# EAGLE schematic ps2 (EAGLE 9.6.1)
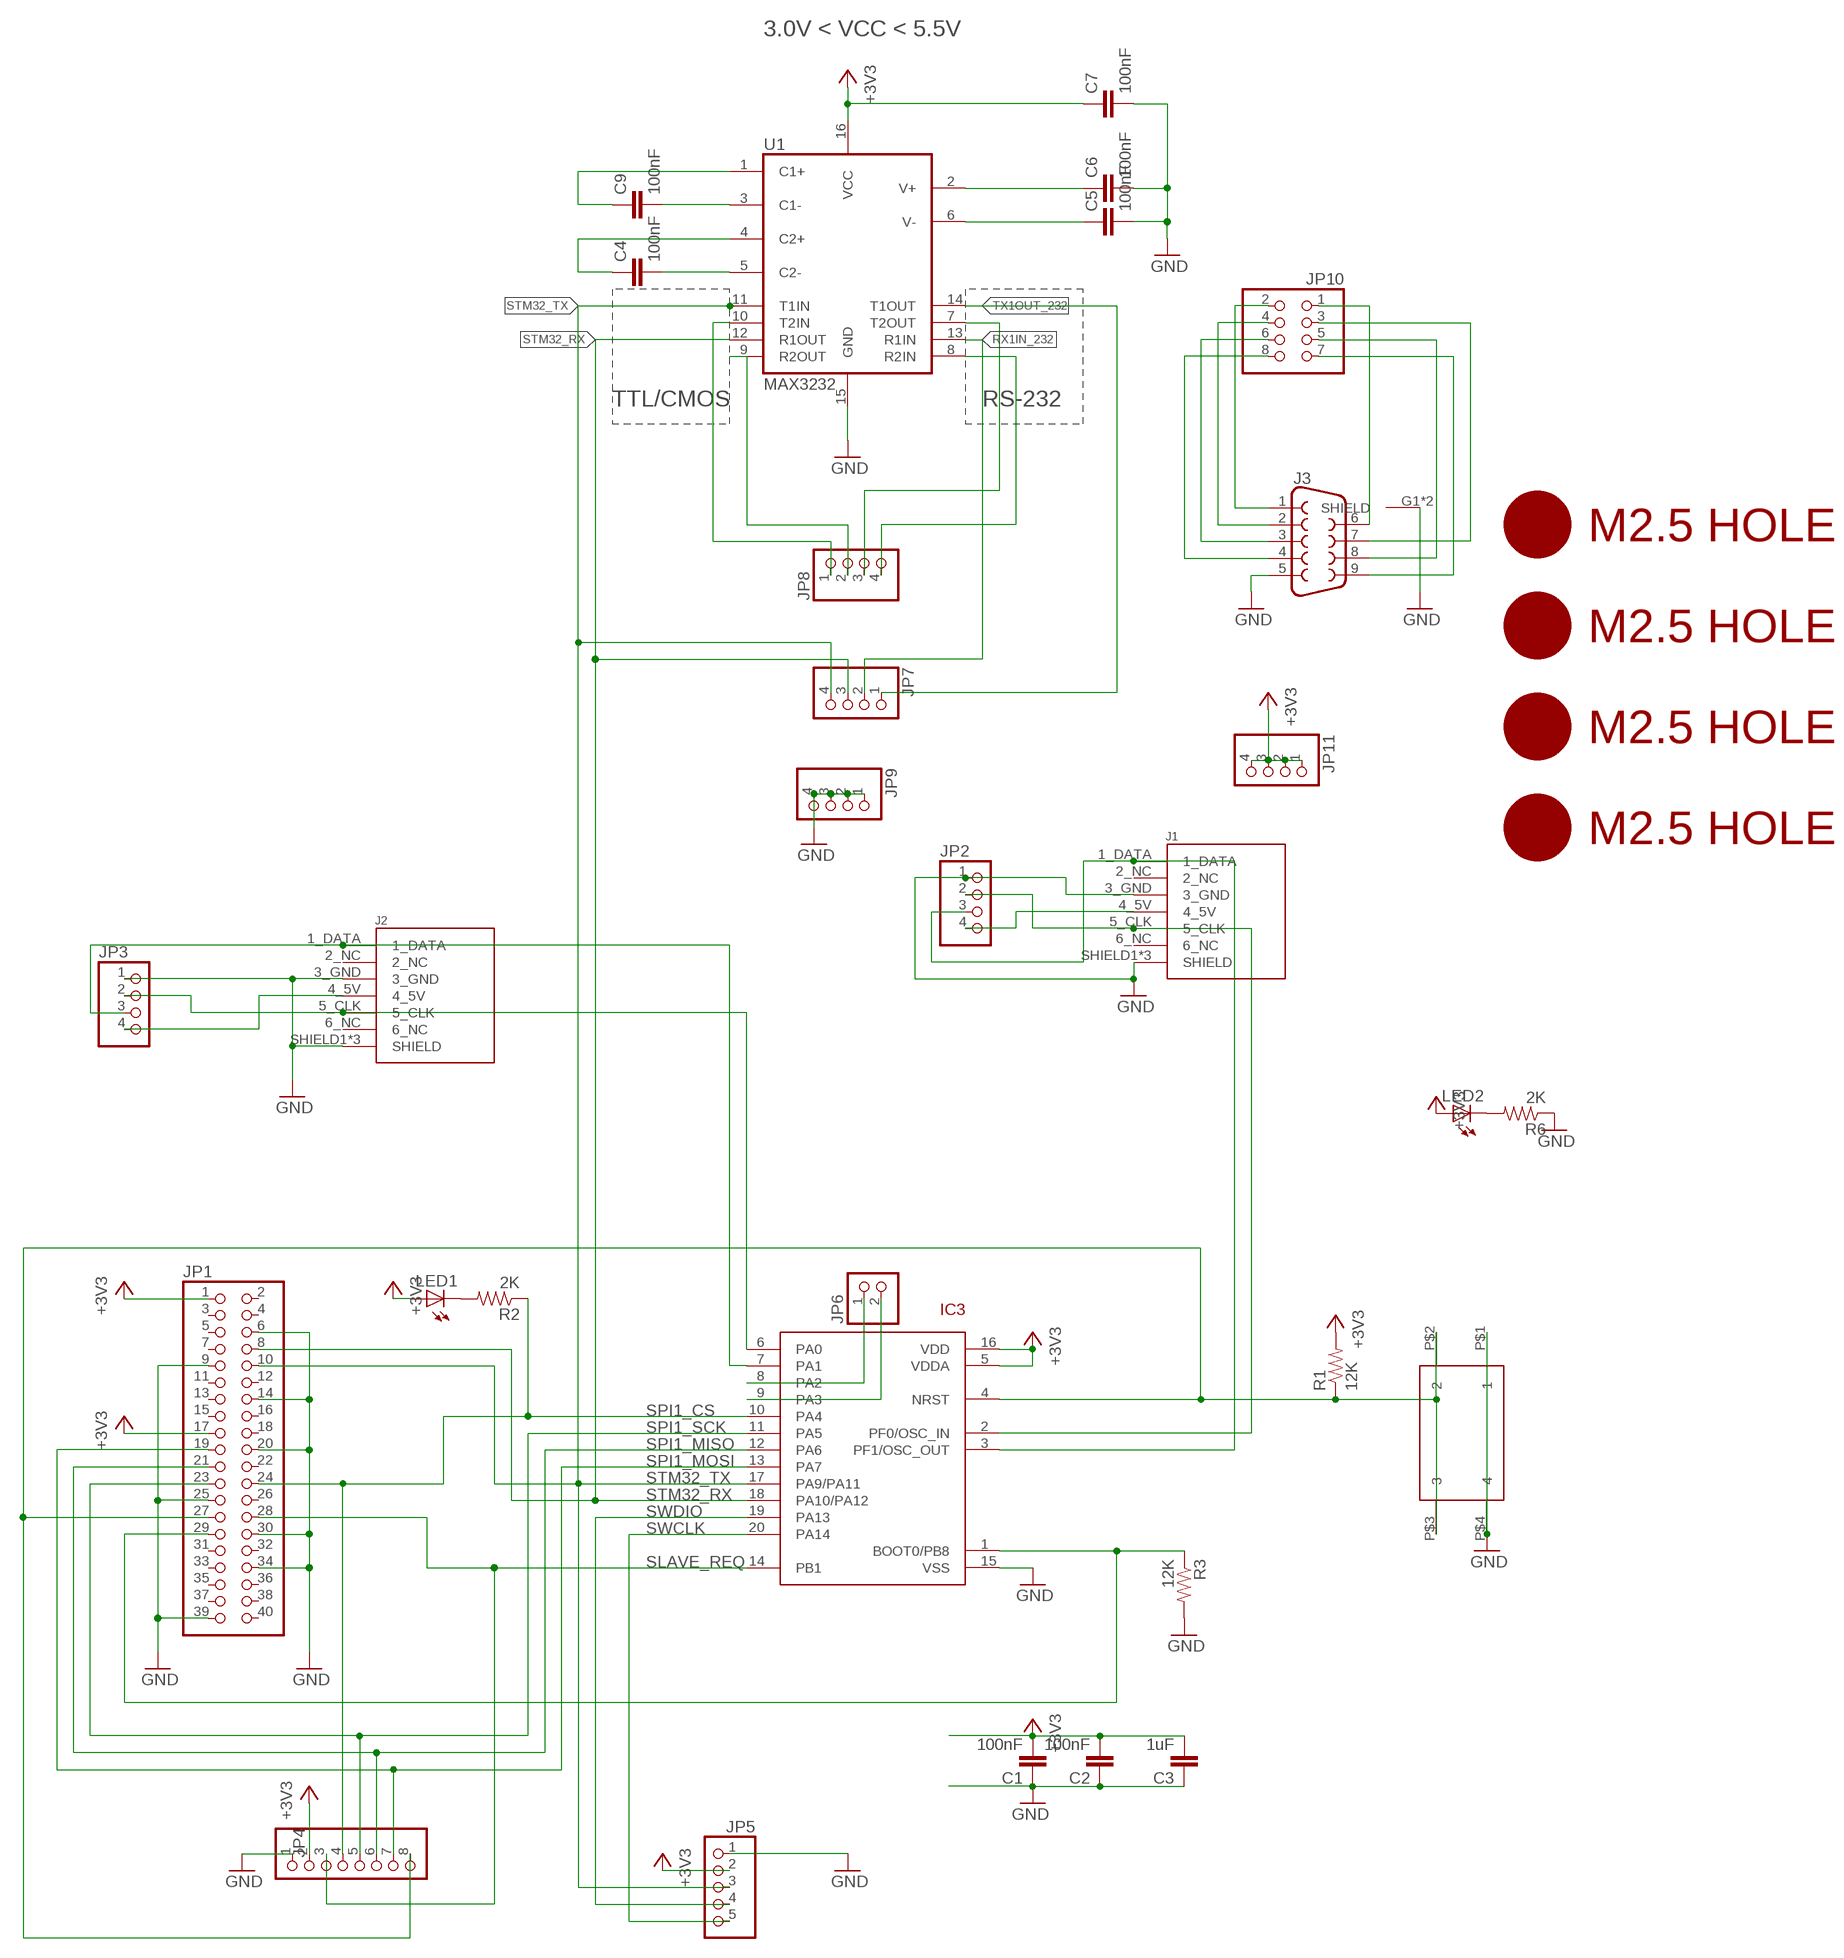
[diagram p0: schematic, sheet 1]

## Parts
C1  100nF  CAP0805  [0805@1]
C2  100nF  CAP0805  [0805@1]
C3  1uF  CAP0805  [0805@1]
C4  100nF  CAP0805  [0805@1]
C5  100nF  CAP0805  [0805@1]
C6  100nF  CAP0805  [0805@1]
C7  100nF  CAP0805  [0805@1]
C9  100nF  CAP0805  [0805@1]
IC3  STM32F042F4  [TSSOP20]
J1  DIN7  [DIN7]
J2  DIN7  [DIN7]
J3  DB9MALE  [DB9_MALE]
JP1  PINHD-2X20-BIG  [2X20-BIG]
JP2  PINHD-1X4  [1X04]
JP3  PINHD-1X4  [1X04]
JP4  PINHD-1X8  [1X08]
JP5  PINHD-1X5  [1X05]
JP6  PINHD-1X2  [1X02]
JP7  PINHD-1X4  [1X04]
JP8  PINHD-1X4  [1X04]
JP9  PINHD-1X4  [1X04]
JP10  PINHD-2X4  [2X04]
JP11  PINHD-1X4  [1X04]
LED1  LEDCHIP-LED0805  [CHIP-LED0805]
LED2  LEDCHIP-LED0805  [CHIP-LED0805]
R1  12K  RESISTOR0805-RES  [0805]
R2  2K  RESISTOR0805-RES  [0805]
R3  12K  RESISTOR0805-RES  [0805]
R6  2K  RESISTOR0805-RES  [0805]
SW4  324_SW  [342_SWICH_FOOT]
U1  MAX3232  MAX232SOIC16  [SO016]
U$2  M2.5HOLE  [M2.5HOLE]
U$3  M2.5HOLE  [M2.5HOLE]
U$4  M2.5HOLE  [M2.5HOLE]
U$5  M2.5HOLE  [M2.5HOLE]

## Nets
+3V3: C1.2 C2.2 C3.2 C7.1 IC3.5(VDDA) IC3.16(VDD) JP1.1 JP1.17 JP4.2 JP5.2 JP11.1 JP11.2 JP11.3 JP11.4 LED1.A LED2.A R1.2 U1.16(VCC)
C1+: C9.1 U1.1(C1+)
C1-: C9.2 U1.3(C1-)
C2+: C4.1 U1.4(C2+)
C2-: C4.2 U1.5(C2-)
GND: C1.1 C2.1 C3.1 C5.2 C6.2 C7.2 IC3.15(VSS) J1.3_GND J1.SHIELD1(SHIELD) J1.SHIELD2(SHIELD) J1.SHIELD3(SHIELD) J2.3_GND J2.SHIELD1(SHIELD) J2.SHIELD2(SHIELD) J2.SHIELD3(SHIELD) J3.5 J3.G1(SHIELD) J3.G2(SHIELD) JP1.6 JP1.9 JP1.14 JP1.20 JP1.25 JP1.30 JP1.34 JP1.39 JP2.1 JP3.1 JP4.1 JP5.1 JP9.1 JP9.2 JP9.3 JP9.4 R3.2 R6.1 SW4.P$1 SW4.P$4 U1.15(GND)
N$1: IC3.4(NRST) JP1.27 JP4.8 R1.1 SW4.P$2 SW4.P$3
N$2: LED1.C R2.2
N$3: J1.4_5V JP2.4
N$4: J2.4_5V JP3.4
N$5: IC3.2(PF0/OSC_IN) J1.5_CLK JP2.2
N$6: IC3.3(PF1/OSC_OUT) J1.1_DATA JP2.3
N$7: IC3.6(PA0) J2.5_CLK JP3.2
N$8: IC3.7(PA1) J2.1_DATA JP3.3
N$9: IC3.1(BOOT0/PB8) JP1.29 R3.1
N$10: IC3.8(PA2) JP6.1
N$11: IC3.9(PA3) JP6.2
N$12: JP8.1 U1.10(T2IN)
N$13: JP8.2 U1.9(R2OUT)
N$14: JP8.3 U1.7(T2OUT)
N$15: JP8.4 U1.8(R2IN)
N$16: J3.1 JP10.2
N$17: J3.2 JP10.4
N$18: J3.3 JP10.6
N$19: J3.4 JP10.8
N$20: J3.6 JP10.1
N$21: J3.7 JP10.3
N$22: J3.8 JP10.5
N$23: J3.9 JP10.7
N$29: LED2.C R6.2
RX1IN_232: JP7.2 U1.13(R1IN)
SLAVE_REQ: IC3.14(PB1) JP1.28 JP4.3
SPI1_CS: IC3.10(PA4) JP1.24 JP4.4 R2.1
SPI1_MISO: IC3.12(PA6) JP1.21 JP4.6
SPI1_MOSI: IC3.13(PA7) JP1.19 JP4.7
SPI1_SCK: IC3.11(PA5) JP1.23 JP4.5
STM32_RX: IC3.18(PA10/PA12) JP1.8 JP7.3 U1.12(R1OUT)
STM32_TX: IC3.17(PA9/PA11) JP1.10 JP5.3 JP7.4 U1.11(T1IN)
SWCLK: IC3.20(PA14) JP5.5
SWDIO: IC3.19(PA13) JP5.4
TX1OUT_232: JP7.1 U1.14(T1OUT)
V+: C6.1 U1.2(V+)
V-: C5.1 U1.6(V-)
Unconnected: J1.2_NC J1.6_NC J2.2_NC J2.6_NC JP1.2 JP1.3 JP1.4 JP1.5 JP1.7 JP1.11 JP1.12 JP1.13 JP1.15 JP1.16 JP1.18 JP1.22 JP1.26 JP1.31 JP1.32 JP1.33 JP1.35 JP1.36 JP1.37 JP1.38 JP1.40

## Notes on the sheet
- 3.0V < VCC < 5.5V
- TTL/CMOS | RS-232

## Library data of the parts
C1-C7 C9 = clock:CAP: Capacitor Standard 0603 ceramic capacitor, and 0.1" leaded capacitor.
IC3 = tx:STM32F042F4
J1 J2 = SparkFun-Connectors:DIN7: Mini-DIN7 Connector Through-hole MiniDIN 7 connector. Commonly used with Roomba products. Don't confuse this with DIN-6, which is commonly used on oldschool keyboards and mice. Here is the female version connector we sell at SparkFun: MiniDIN 7-Pin Connector <https://www.sparkfun.com/products/696> (PRT-00696); PROD_ID: CONN-08318; SF_ID: PRT-00696
J3 = SparkFun-Connectors:DB9: DB9 Connector Standard DB9 (D-Sub 9) serial connector. Can be used for CAN bus as well as RS485 and RS232. Footprint production proven. Here is the female version connector we sell at SparkFun: 9 Pin Female Serial Connector - PCB Mount <https://www.sparkfun.com/products/429> (PRT-00429) This connector has been used on the following SparkFun products: SparkFun RS232 Shifter - SMD <https://www.sparkfun.com/products/449> (PRT-00449) SparkFun RS232 Shifter SMD (No DB9) <https://www.sparkfun.com/products/8780> (PRT-08780); PROD_ID: CONN-09904
JP1 = adafruit_changed:PINHD-2X20: PIN HEADER
JP2 JP3 JP7-JP9 JP11 = pinhead:PINHD-1X4: PIN HEADER
JP4 = pinhead:PINHD-1X8: PIN HEADER
JP5 = pinhead:PINHD-1X5: PIN HEADER
JP6 = pinhead:PINHD-1X2: PIN HEADER
JP10 = pinhead:PINHD-2X4: PIN HEADER
LED1 LED2 = adafruit:LED: LED OSRAM: - CHIPLED LG R971, LG N971, LY N971, LG Q971, LY Q971, LO R971, LY R971 LH N974, LH R974 LS Q976, LO Q976, LY Q976 LO Q996 - Hyper CHIPLED LW Q18S LB Q993, LB Q99A, LB R99A - SideLED LS A670, LO A670, LY A670, LG A670, LP A670 LB A673, LV A673, LT A673, LW A673 LH A674 LY A675 LS A676, LA A676, LO A676, LY A676, LW A676 LS A679, LY A679, LG A679 - Hyper Micro SIDELED® LS Y876, LA Y876, LO Y876, LY Y876 LT Y87S - SmartLED LW L88C, LW L88S LB L89C, LB L89S, LG L890 LS L89K, LO L89K, LY L89K LS L896, LA L896, LO L896, LY L896 - TOPLED LS T670, LO T670, LY T670, LG T670, LP T670 LSG T670, LSP T670, LSY T670, LOP T670, LYG T670 LG T671, LOG T671, LSG T671 LB T673, LV T673, LT T673, LW T673 LH T674 LS T676, LA T676, LO T676, LY T676, LB T676, LH T676, LSB T676, LW T676 LB T67C, LV T67C, LT T67C, LS T67K, LO T67K, LY T67K, LW E67C LS E67B, LA E67B, LO E67B, LY E67B, LB E67C, LV E67C, LT E67C LW T67C LS T679, LY T679, LG T679 LS T770, LO T770, LY T770, LG T770, LP T770 LB T773, LV T773, LT T773, LW T773 LH T774 LS E675, LA E675, LY E675, LS T675 LS T776, LA T776, LO T776, LY T776, LB T776 LHGB T686 LT T68C, LB T68C - Hyper Mini TOPLED® LB M676 - Mini TOPLED Santana® LG M470 LS M47K, LO M47K, LY M47K Source: http://www.osram.convergy.de/
R1-R3 R6 = SparkFun-Passives:RESISTOR: Resistor Basic schematic elements and footprints for 0603, 1206, and PTH resistors.
SW4 = 3pos_slide_switch_centered:324_SW
U1 = SparkFun-DigitalIC:MAX232: RS232 Transceiver Very common IC. This is generically called 'MAX232', but works with the 3V equivalent MAX3232 generic ICs. Field tested and mother approved. Spark Fun Electronics SKU : COM-00316 (DIP) and COM-00589 (SMD); PROD_ID: IC-08171
U$2-U$5 = f1c100s:M2.5HOLE

## Net classes
1 power: width 0.178 mm